# EAGLE design New_Schematic (EAGLE 9.6.2)
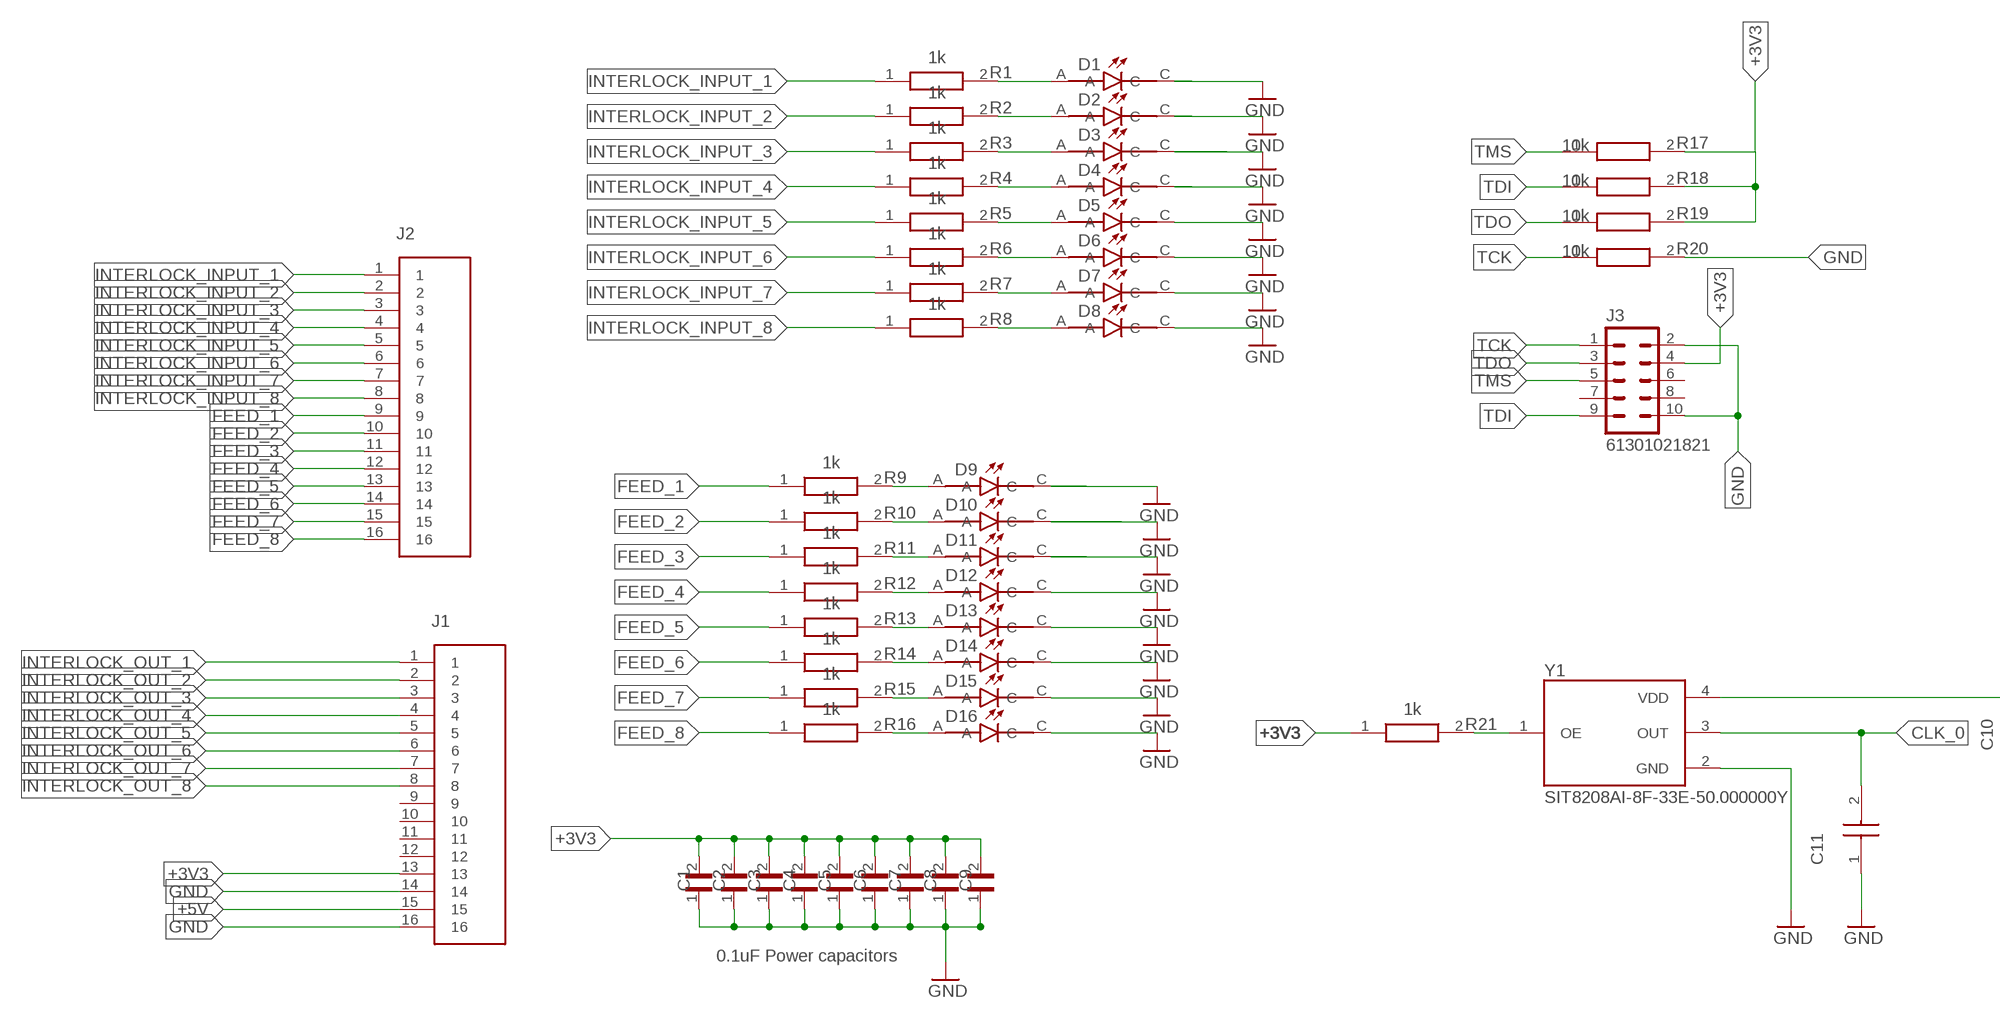
[diagram p0: schematic, sheet 1, part 1 of 2]
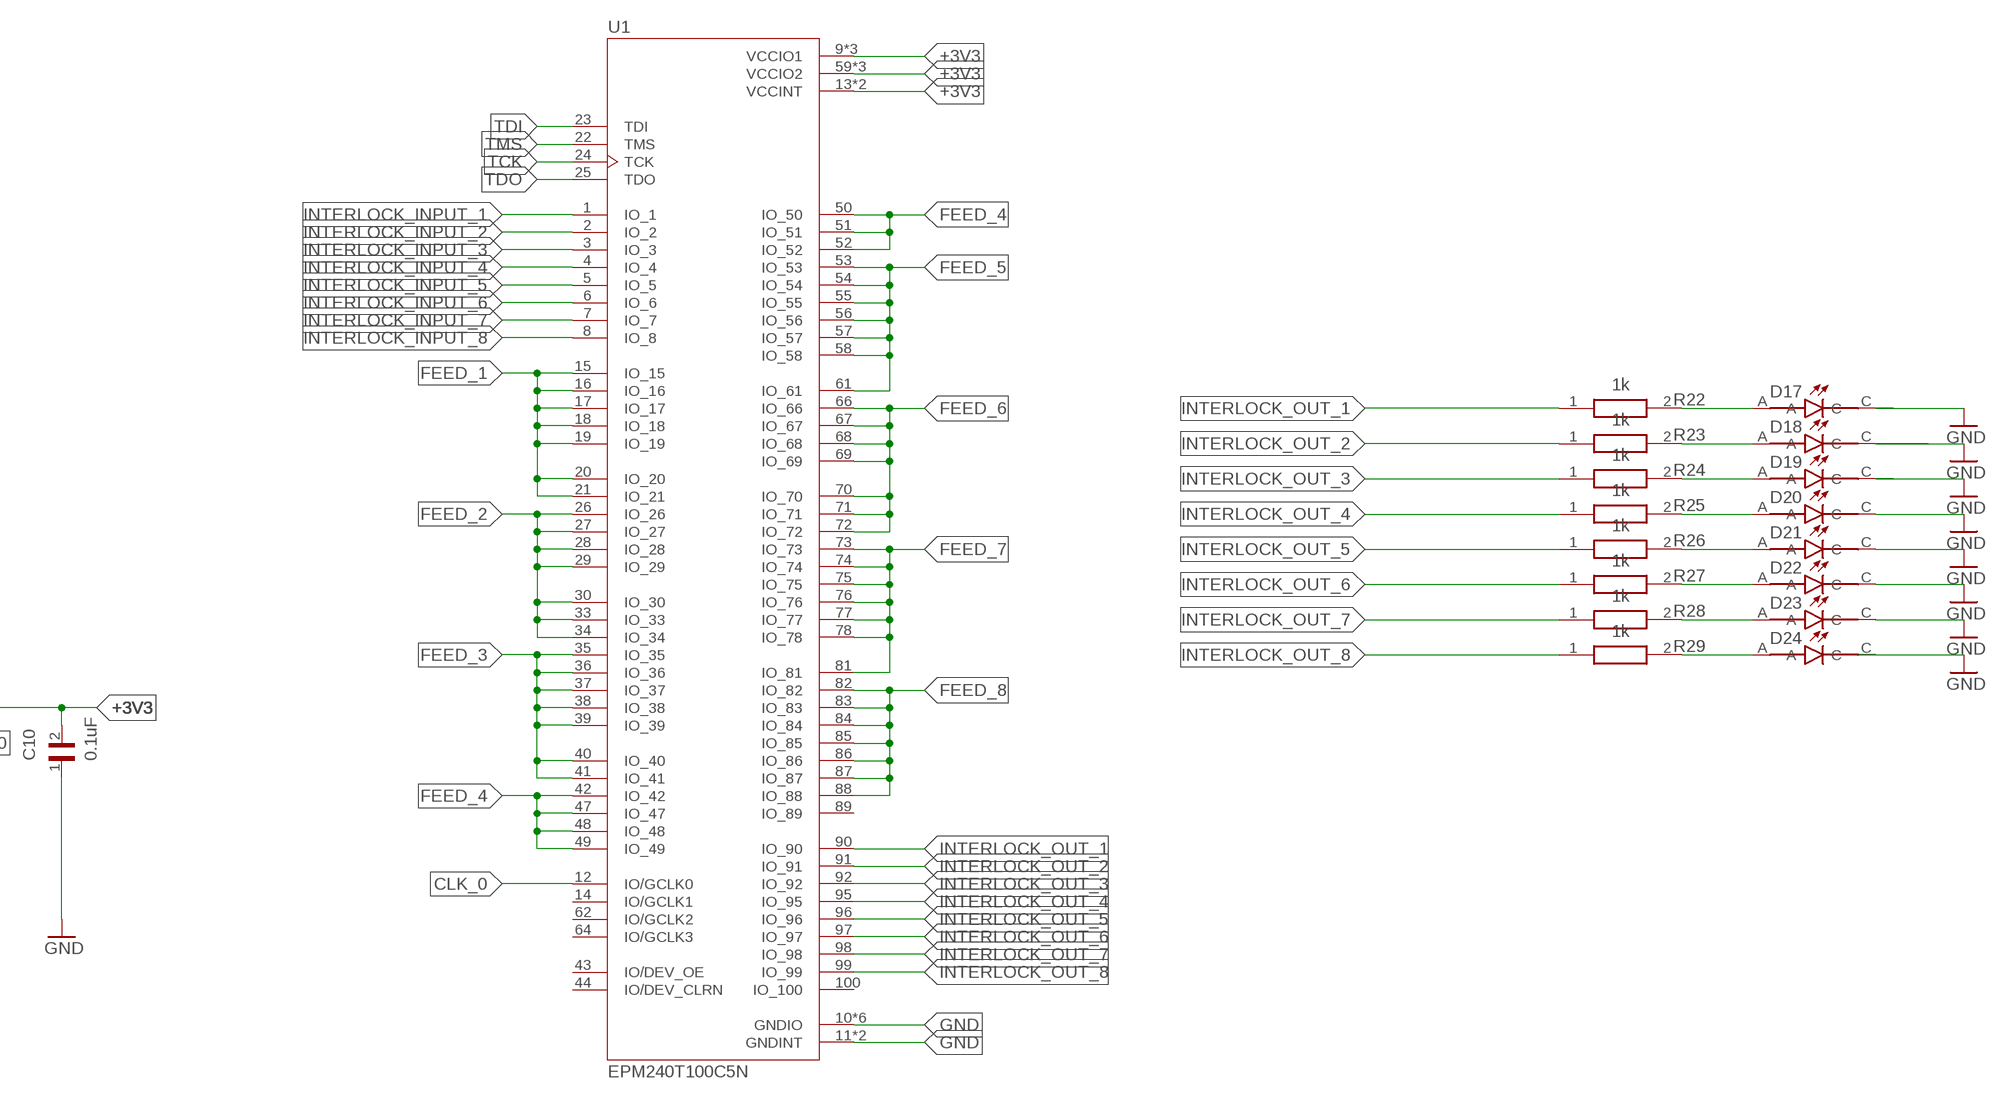
[diagram p1: schematic, sheet 1, part 2 of 2]

## Parts
C1  GRM155R70J104KA01D  [CAPC1005X55N]
C2  GRM155R70J104KA01D  [CAPC1005X55N]
C3  GRM155R70J104KA01D  [CAPC1005X55N]
C4  GRM155R70J104KA01D  [CAPC1005X55N]
C5  GRM155R70J104KA01D  [CAPC1005X55N]
C6  GRM155R70J104KA01D  [CAPC1005X55N]
C7  GRM155R70J104KA01D  [CAPC1005X55N]
C8  GRM155R70J104KA01D  [CAPC1005X55N]
C9  GRM155R70J104KA01D  [CAPC1005X55N]
C10  GRM155R70J104KA01D  [CAPC1005X55N]
C11  GRM1883U2A150JZ01B  [CAPC1608X90N]
D1  HSMS-C190  [LEDM1608X80]
D2  HSMS-C190  [LEDM1608X80]
D3  HSMS-C190  [LEDM1608X80]
D4  HSMS-C190  [LEDM1608X80]
D5  HSMS-C190  [LEDM1608X80]
D6  HSMS-C190  [LEDM1608X80]
D7  HSMS-C190  [LEDM1608X80]
D8  HSMS-C190  [LEDM1608X80]
D9  HSMS-C190  [LEDM1608X80]
D10  HSMS-C190  [LEDM1608X80]
D11  HSMS-C190  [LEDM1608X80]
D12  HSMS-C190  [LEDM1608X80]
D13  HSMS-C190  [LEDM1608X80]
D14  HSMS-C190  [LEDM1608X80]
D15  HSMS-C190  [LEDM1608X80]
D16  HSMS-C190  [LEDM1608X80]
D17  HSMS-C190  [LEDM1608X80]
D18  HSMS-C190  [LEDM1608X80]
D19  HSMS-C190  [LEDM1608X80]
D20  HSMS-C190  [LEDM1608X80]
D21  HSMS-C190  [LEDM1608X80]
D22  HSMS-C190  [LEDM1608X80]
D23  HSMS-C190  [LEDM1608X80]
D24  HSMS-C190  [LEDM1608X80]
J1  1-2314812-6  [TE_1-2314812-6]
J2  1-2314812-6  [TE_1-2314812-6]
J3  61301021821  [2X05-PIN]
R1  ERJS03D1001V  [RESC1608X55N]
R2  ERJS03D1001V  [RESC1608X55N]
R3  ERJS03D1001V  [RESC1608X55N]
R4  ERJS03D1001V  [RESC1608X55N]
R5  ERJS03D1001V  [RESC1608X55N]
R6  ERJS03D1001V  [RESC1608X55N]
R7  ERJS03D1001V  [RESC1608X55N]
R8  ERJS03D1001V  [RESC1608X55N]
R9  ERJS03D1001V  [RESC1608X55N]
R10  ERJS03D1001V  [RESC1608X55N]
R11  ERJS03D1001V  [RESC1608X55N]
R12  ERJS03D1001V  [RESC1608X55N]
R13  ERJS03D1001V  [RESC1608X55N]
R14  ERJS03D1001V  [RESC1608X55N]
R15  ERJS03D1001V  [RESC1608X55N]
R16  ERJS03D1001V  [RESC1608X55N]
R17  CRT0603-BY-1002EAS  [RESC1608X60N]
R18  CRT0603-BY-1002EAS  [RESC1608X60N]
R19  CRT0603-BY-1002EAS  [RESC1608X60N]
R20  CRT0603-BY-1002EAS  [RESC1608X60N]
R21  ERJS03D1001V  [RESC1608X55N]
R22  ERJS03D1001V  [RESC1608X55N]
R23  ERJS03D1001V  [RESC1608X55N]
R24  ERJS03D1001V  [RESC1608X55N]
R25  ERJS03D1001V  [RESC1608X55N]
R26  ERJS03D1001V  [RESC1608X55N]
R27  ERJS03D1001V  [RESC1608X55N]
R28  ERJS03D1001V  [RESC1608X55N]
R29  ERJS03D1001V  [RESC1608X55N]
U1  EPM240T100C5N  [QFP50P1600X1600X120-100N]
Y1  SIT8208AI-8F-33E-50.000000Y  [OSC_SIT8208AI-8F-33E-50.000000Y]

## Nets
+3V3: C1.2 C2.2 C3.2 C4.2 C5.2 C6.2 C7.2 C8.2 C9.2 C10.2 J1.13 J3.4 R17.2 R18.2 R19.2 R21.1 U1.9(VCCIO1) U1.13(VCCINT) U1.31(VCCIO1) U1.45(VCCIO1) U1.59(VCCIO2) U1.63(VCCINT) U1.80(VCCIO2) U1.94(VCCIO2) Y1.4(VDD)
+5V: J1.15
CLK_0: C11.2 U1.12(IO/GCLK0) Y1.3(OUT)
FEED_1: J2.9 R9.1 U1.15(IO_15) U1.16(IO_16) U1.17(IO_17) U1.18(IO_18) U1.19(IO_19) U1.20(IO_20) U1.21(IO_21)
FEED_2: J2.10 R10.1 U1.26(IO_26) U1.27(IO_27) U1.28(IO_28) U1.29(IO_29) U1.30(IO_30) U1.33(IO_33) U1.34(IO_34)
FEED_3: J2.11 R11.1 U1.35(IO_35) U1.36(IO_36) U1.37(IO_37) U1.38(IO_38) U1.39(IO_39) U1.40(IO_40) U1.41(IO_41)
FEED_4: J2.12 R12.1 U1.42(IO_42) U1.47(IO_47) U1.48(IO_48) U1.49(IO_49) U1.50(IO_50) U1.51(IO_51) U1.52(IO_52)
FEED_5: J2.13 R13.1 U1.53(IO_53) U1.54(IO_54) U1.55(IO_55) U1.56(IO_56) U1.57(IO_57) U1.58(IO_58) U1.61(IO_61)
FEED_6: J2.14 R14.1 U1.66(IO_66) U1.67(IO_67) U1.68(IO_68) U1.69(IO_69) U1.70(IO_70) U1.71(IO_71) U1.72(IO_72)
FEED_7: J2.15 R15.1 U1.73(IO_73) U1.74(IO_74) U1.75(IO_75) U1.76(IO_76) U1.77(IO_77) U1.78(IO_78) U1.81(IO_81)
FEED_8: J2.16 R16.1 U1.82(IO_82) U1.83(IO_83) U1.84(IO_84) U1.85(IO_85) U1.86(IO_86) U1.87(IO_87) U1.88(IO_88)
GND: C1.1 C2.1 C3.1 C4.1 C5.1 C6.1 C7.1 C8.1 C9.1 C10.1 C11.1 D1.C D2.C D3.C D4.C D5.C D6.C D7.C D8.C D9.C D10.C D11.C D12.C D13.C D14.C D15.C D16.C D17.C D18.C D19.C D20.C D21.C D22.C D23.C D24.C J1.14 J1.16 J3.2 J3.10 R20.2 U1.10(GNDIO) U1.11(GNDINT) U1.32(GNDIO) U1.46(GNDIO) U1.60(GNDIO) U1.65(GNDINT) U1.79(GNDIO) U1.93(GNDIO) Y1.2(GND)
INTERLOCK_INPUT_1: J2.1 R1.1 U1.1(IO_1)
INTERLOCK_INPUT_2: J2.2 R2.1 U1.2(IO_2)
INTERLOCK_INPUT_3: J2.3 R3.1 U1.3(IO_3)
INTERLOCK_INPUT_4: J2.4 R4.1 U1.4(IO_4)
INTERLOCK_INPUT_5: J2.5 R5.1 U1.5(IO_5)
INTERLOCK_INPUT_6: J2.6 R6.1 U1.6(IO_6)
INTERLOCK_INPUT_7: J2.7 R7.1 U1.7(IO_7)
INTERLOCK_INPUT_8: J2.8 R8.1 U1.8(IO_8)
INTERLOCK_OUT_1: J1.1 R22.1 U1.90(IO_90)
INTERLOCK_OUT_2: J1.2 R23.1 U1.91(IO_91)
INTERLOCK_OUT_3: J1.3 R24.1 U1.92(IO_92)
INTERLOCK_OUT_4: J1.4 R25.1 U1.95(IO_95)
INTERLOCK_OUT_5: J1.5 R26.1 U1.96(IO_96)
INTERLOCK_OUT_6: J1.6 R27.1 U1.97(IO_97)
INTERLOCK_OUT_7: J1.7 R28.1 U1.98(IO_98)
INTERLOCK_OUT_8: J1.8 R29.1 U1.99(IO_99)
N$1: D2.A R2.2
N$2: D3.A R3.2
N$3: D4.A R4.2
N$4: D5.A R5.2
N$5: D6.A R6.2
N$6: D7.A R7.2
N$7: D8.A R8.2
N$8: D16.A R16.2
N$9: D1.A R1.2
N$10: R21.2 Y1.1(OE)
N$11: D9.A R9.2
N$12: D17.A R22.2
N$13: D18.A R23.2
N$14: D10.A R10.2
N$15: D11.A R11.2
N$16: D12.A R12.2
N$17: D13.A R13.2
N$18: D14.A R14.2
N$19: D15.A R15.2
N$29: D19.A R24.2
N$30: D20.A R25.2
N$31: D21.A R26.2
N$32: D22.A R27.2
N$33: D23.A R28.2
N$34: D24.A R29.2
TCK: J3.1 R20.1 U1.24(TCK)
TDI: J3.9 R18.1 U1.23(TDI)
TDO: J3.3 R19.1 U1.25(TDO)
TMS: J3.5 R17.1 U1.22(TMS)
Unconnected: J1.9 J1.10 J1.11 J1.12 J3.6 J3.7 J3.8 U1.14(IO/GCLK1) U1.43(IO/DEV_OE) U1.44(IO/DEV_CLRN) U1.62(IO/GCLK2) U1.64(IO/GCLK3) U1.89(IO_89) U1.100(IO_100)

## Notes on the sheet
- 0.1uF Power capacitors

## Library data of the parts
C1-C9 = GRM155R70J104KA01D:GRM155R70J104KA01D: CAP, MLCC, X7R, 0.1UF, 6.3V, 0402; CHECK_PRICES: https://www.snapeda.com/parts/GRM155R70J104KA01D/Murata+Electronics+North+America/view-part/?ref=eda; DESCRIPTION: SMD Capacitor X7R(EIA) with Capacitance: 0.10uF Tol. 10%. Rated Voltage: 6.3Vdc; DIGIKEY_PART_NUMBER: 490-6319-2-ND; MF: Murata; MP: GRM155R70J104KA01D; PACKAGE: 1005 Taiyo Yuden; PURCHASE-URL: https://www.snapeda.com/api/url_track_click_mouser/?unipart_id=287038&manufacturer=Murata&part_name=GRM155R70J104KA01D&search_term=0.1uf cap; SNAPEDA_LINK: https://www.snapeda.com/parts/GRM155R70J104KA01D/Murata+Electronics+North+America/view-part/?ref=snap
C10 = GRM155R70J104KA01D:GRM155R70J104KA01D: CAP, MLCC, X7R, 0.1UF, 6.3V, 0402; C10: 0.1uF; CHECK_PRICES: https://www.snapeda.com/parts/GRM155R70J104KA01D/Murata+Electronics+North+America/view-part/?ref=eda; DESCRIPTION: SMD Capacitor X7R(EIA) with Capacitance: 0.10uF Tol. 10%. Rated Voltage: 6.3Vdc; DIGIKEY_PART_NUMBER: 490-6319-2-ND; MF: Murata; MP: GRM155R70J104KA01D; PACKAGE: 1005 Taiyo Yuden; PURCHASE-URL: https://www.snapeda.com/api/url_track_click_mouser/?unipart_id=287038&manufacturer=Murata&part_name=GRM155R70J104KA01D&search_term=0.1uf cap; SNAPEDA_LINK: https://www.snapeda.com/parts/GRM155R70J104KA01D/Murata+Electronics+North+America/view-part/?ref=snap
C11 = GRM1883U2A150JZ01B:GRM1883U2A150JZ01B: Multilayer Ceramic Capacitors MLCC - SMD/SMT Source: Datasheet <http://componentsearchengine.com/Datasheets/1/GRM1883U2A150JZ01B.pdf>; C11: 15pF; DESCRIPTION: Multilayer Ceramic Capacitors MLCC - SMD/SMT; HEIGHT: 0.9mm; MANUFACTURER_NAME: Murata Electronics; MANUFACTURER_PART_NUMBER: GRM1883U2A150JZ01B; MOUSER_PART_NUMBER: N/A; MOUSER_PRICE-STOCK: https://www.mouser.com/Search/Refine.aspx?Keyword=N%2FA
D1-D24 = HSMS-C190:HSMS-C190: SMD LED [Broadcom] HSMS-C190 SMD LED Check availability <https://pricing.snapeda.com/parts/HSMS-C190/Broadcom%20Limited/view-part?ref=eda>; AVAILABILITY: In Stock; CHECK_PRICES: https://www.snapeda.com/parts/HSMS-C190/Broadcom+Limited/view-part/?ref=eda; DESCRIPTION: LED; SMD; 0603; red; 2.8-10mcd; 1.6x0.8mm; 170°; 2.1÷2.6V; 20mA; MF: Broadcom Limited; MP: HSMS-C190; PACKAGE: 0603 Avago; PRICE: None; SNAPEDA_LINK: https://www.snapeda.com/parts/HSMS-C190/Broadcom+Limited/view-part/?ref=snap
J1 J2 = 1-2314812-6:1-2314812-6; CHECK_PRICES: https://www.snapeda.com/parts/1-2314812-6/TE+Connectivity/view-part/?ref=eda; COMMENT: 1-2314812-6; DESCRIPTION: Socket Receptacle 16P,2MM,B-B,REC,DRVT,2.0,0.1AU,TB,W/CAP 16 POS; DIGIKEY_PART_NUMBER: 17-1-2314812-6-ND; MF: TE Connectivity; MP: 1-2314812-6; PACKAGE: None; PURCHASE-URL: https://www.snapeda.com/api/url_track_click_mouser/?unipart_id=4241776&manufacturer=TE Connectivity&part_name=1-2314812-6&search_term=1-2314812-6; SNAPEDA_LINK: https://www.snapeda.com/parts/1-2314812-6/TE+Connectivity/view-part/?ref=snap
J3 = 61301021821:61301021821: http://www.mouser.com/ProductDetail/Wurth-Electronics/61301021821/?qs=sGAEpiMZZMs%252bGHln7q6pm%252bxnWLfLL2%2f9OV8dbd6CAaU%3d Check availability <https://pricing.snapeda.com/parts/61301021821/Wurth%20Electronics/view-part?ref=eda>; AVAILABILITY: In Stock; CHECK_PRICES: https://www.snapeda.com/parts/61301021821/Wurth+Electronics+Inc./view-part/?ref=eda; DESCRIPTION: 10 Position Header Connector Through Hole; MF: Wurth Electronics; MP: 61301021821; PACKAGE: None; PRICE: None; PURCHASE-URL: https://www.snapeda.com/api/url_track_click_mouser/?unipart_id=1736865&manufacturer=Wurth Electronics&part_name=61301021821&search_term=connector headers; SNAPEDA_LINK: https://www.snapeda.com/parts/61301021821/Wurth+Electronics+Inc./view-part/?ref=snap
R1-R16 R21-R29 = ERJS03D1001V:ERJS03D1001V: Anti-Sulfurated Thick Film Chip Resistor, 0603, 0.1W Source: Datasheet <https://industrial.panasonic.com/cdbs/www-data/pdf/RDP0000/AOA0000C334.pdf>; DESCRIPTION: Anti-Sulfurated Thick Film Chip Resistor, 0603, 0.1W; HEIGHT: 0.55mm; MANUFACTURER_NAME: Panasonic; MANUFACTURER_PART_NUMBER: ERJS03D1001V; R1: 1k
R17-R20 = CRT0603-BY-1002EAS:CRT0603-BY-1002EAS: Thin Film Resistors - SMD 10k0 0.1% 100mW Source: Datasheet <http://www.bourns.com/docs/Product-Datasheets/crt-as.pdf>; ARROW_PART_NUMBER: CRT0603-BY-1002EAS; ARROW_PRICE-STOCK: https://www.arrow.com/en/products/crt0603-by-1002eas/bourns; DESCRIPTION: Thin Film Resistors - SMD 10k0 0.1% 100mW; HEIGHT: 0.6mm; MANUFACTURER_NAME: Bourns; MANUFACTURER_PART_NUMBER: CRT0603-BY-1002EAS; MOUSER_PART_NUMBER: 652-CRT0603BY1002EAS; MOUSER_PRICE-STOCK: https://www.mouser.com/Search/Refine.aspx?Keyword=652-CRT0603BY1002EAS; R17: 10k
U1 = EPM240T100C5N:EPM240T100C5N: CPLD MAX II Family 192 Macro Cells 201.1MHz 0.18um Technology 2.5V/3.3V 100-Pin TQFP; CHECK_PRICES: https://www.snapeda.com/parts/EPM240T100C5N/Intel/view-part/?ref=eda; DESCRIPTION: IC CPLD 192MC 4.7NS 100TQFP; DIGIKEY_PART_NUMBER: 544-1964-ND; MF: Intel; MP: EPM240T100C5N; PACKAGE: QFN-100 Intel; PURCHASE-URL: https://www.snapeda.com/api/url_track_click_mouser/?unipart_id=38204&manufacturer=Intel&part_name=EPM240T100C5N&search_term=epm240t100c5n; SNAPEDA_LINK: https://www.snapeda.com/parts/EPM240T100C5N/Intel/view-part/?ref=snap
Y1 = SIT8208AI-8F-33E-50.000000Y:SIT8208AI-8F-33E-50.000000Y: Check availability <https://pricing.snapeda.com/parts/SIT8208AI-8F-33E-50.000000Y/SiTime/view-part?ref=eda>; AVAILABILITY: In Stock; CHECK_PRICES: https://www.snapeda.com/parts/SIT8208AI-8F-33E-50.000000Y/SiTime/view-part/?ref=eda; DESCRIPTION: 50 MHz XO (Standard) LVCMOS, LVTTL Oscillator 3.3V Enable/Disable 4-SMD, No Lead; MF: SiTime; MP: SIT8208AI-8F-33E-50.000000Y; PACKAGE: NON STANDARD-4 Rochester Electronics; PRICE: None; SNAPEDA_LINK: https://www.snapeda.com/parts/SIT8208AI-8F-33E-50.000000Y/SiTime/view-part/?ref=snap

## Board
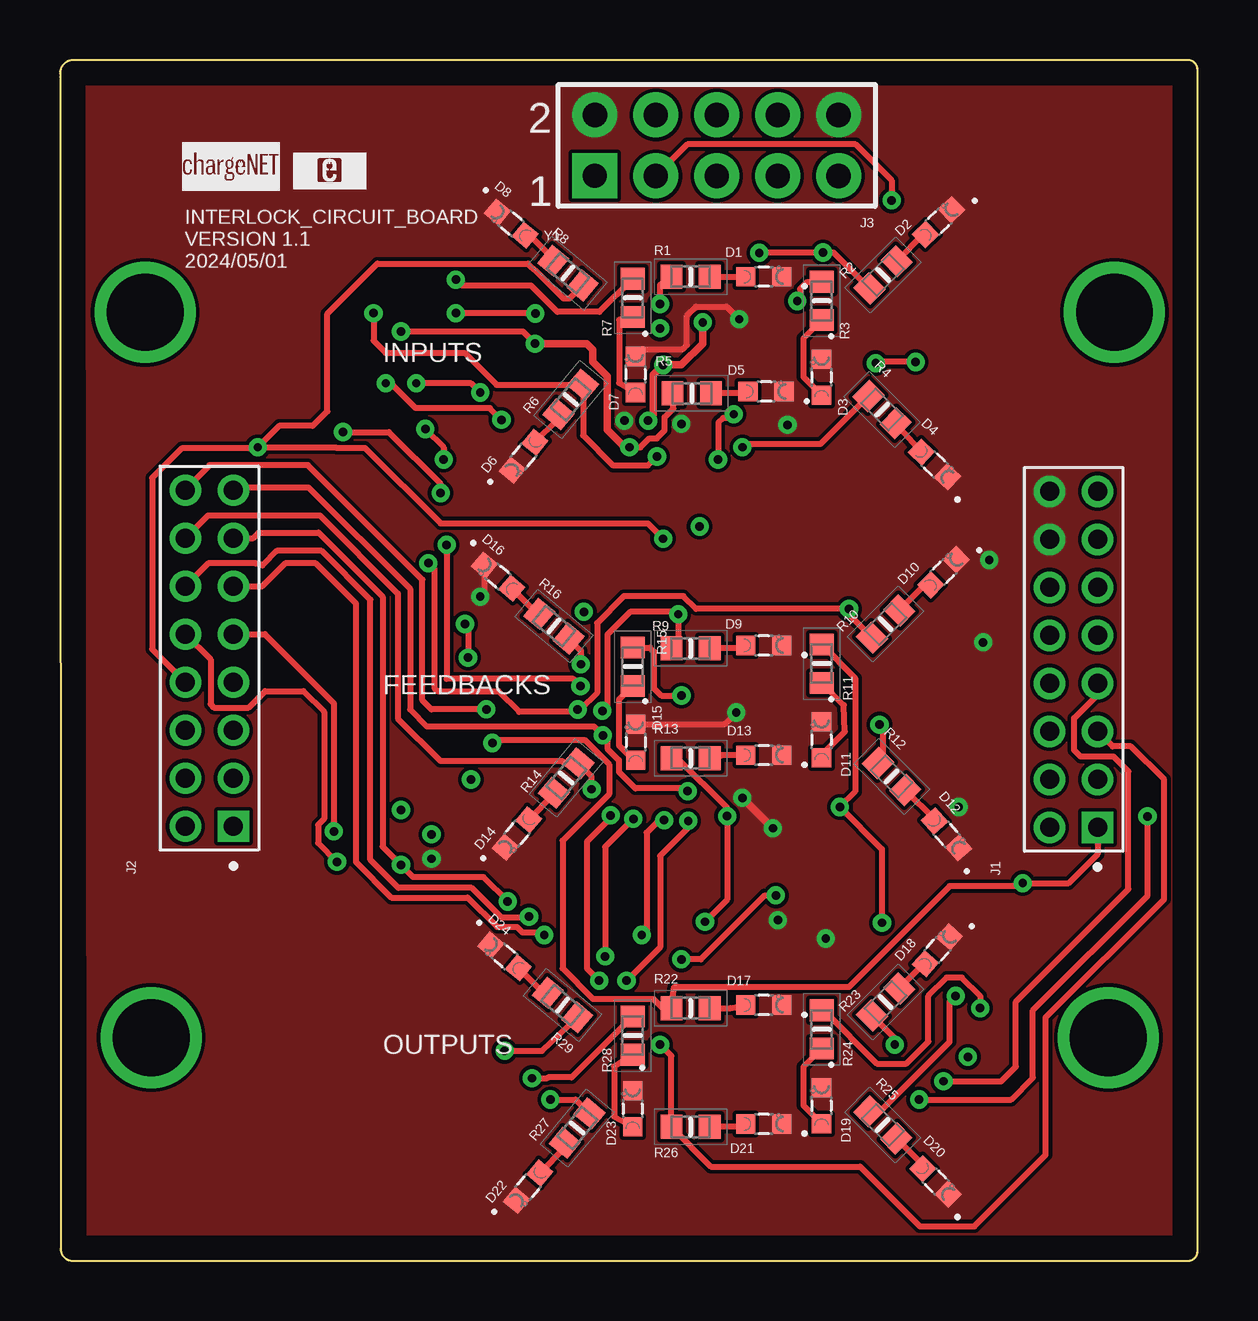
[diagram p2: board, top side]
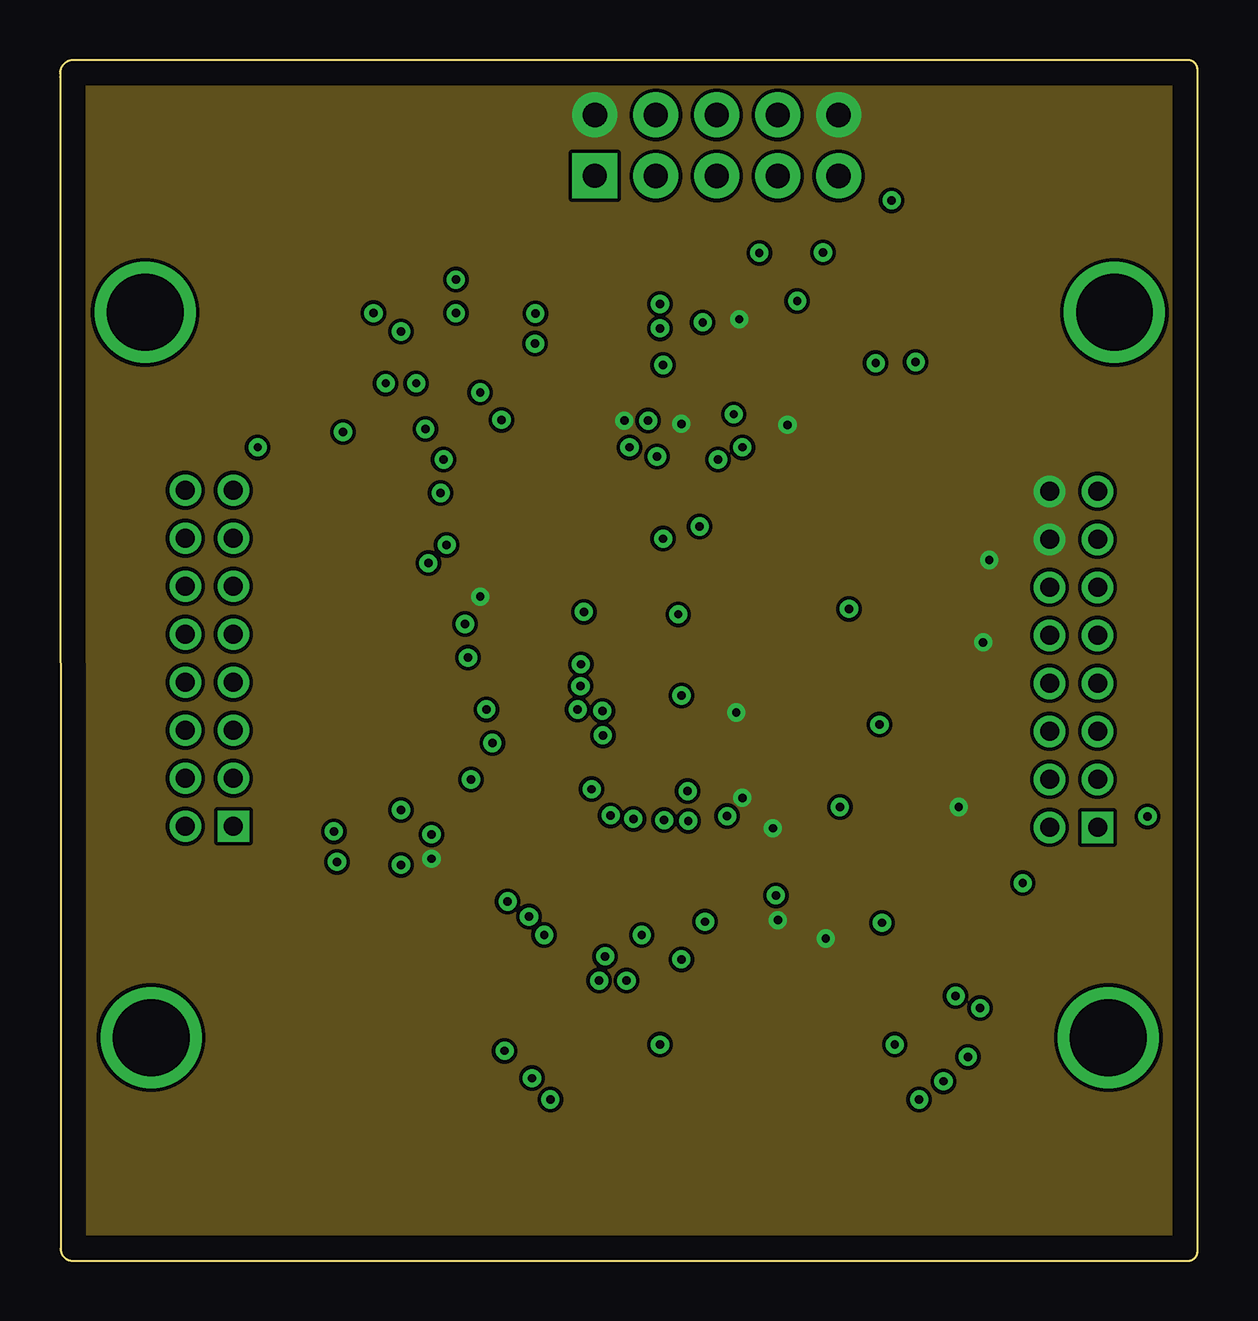
[diagram p3: board, inner layer Route2]
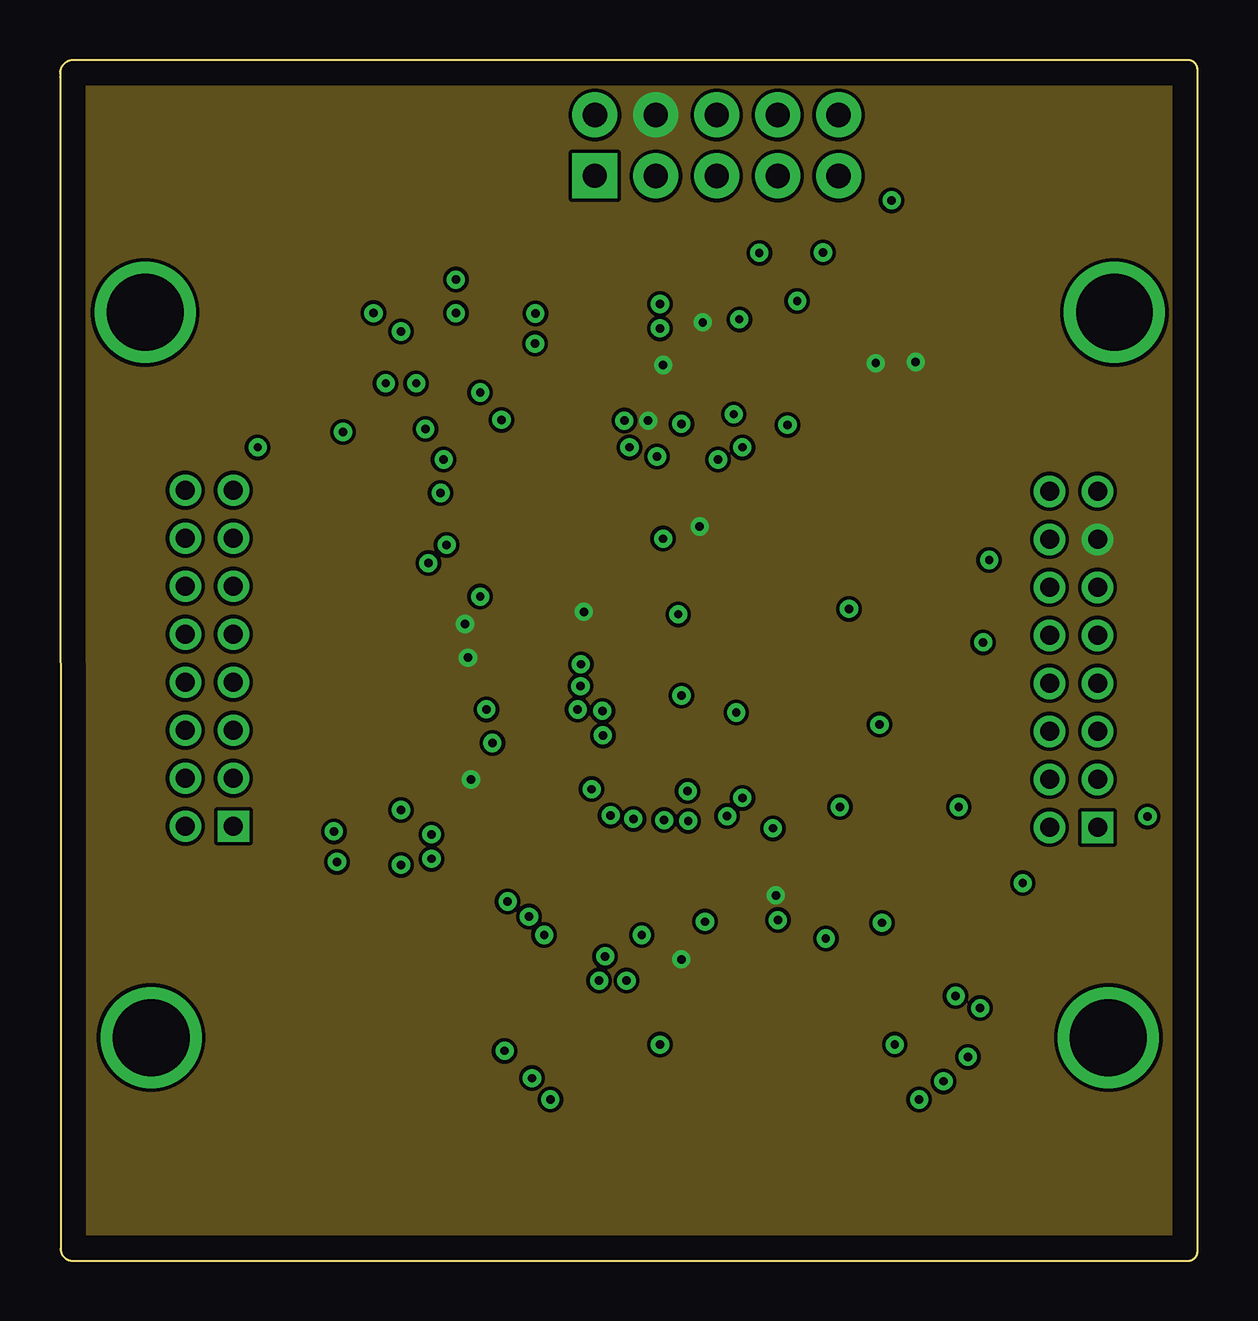
[diagram p4: board, inner layer Route3]
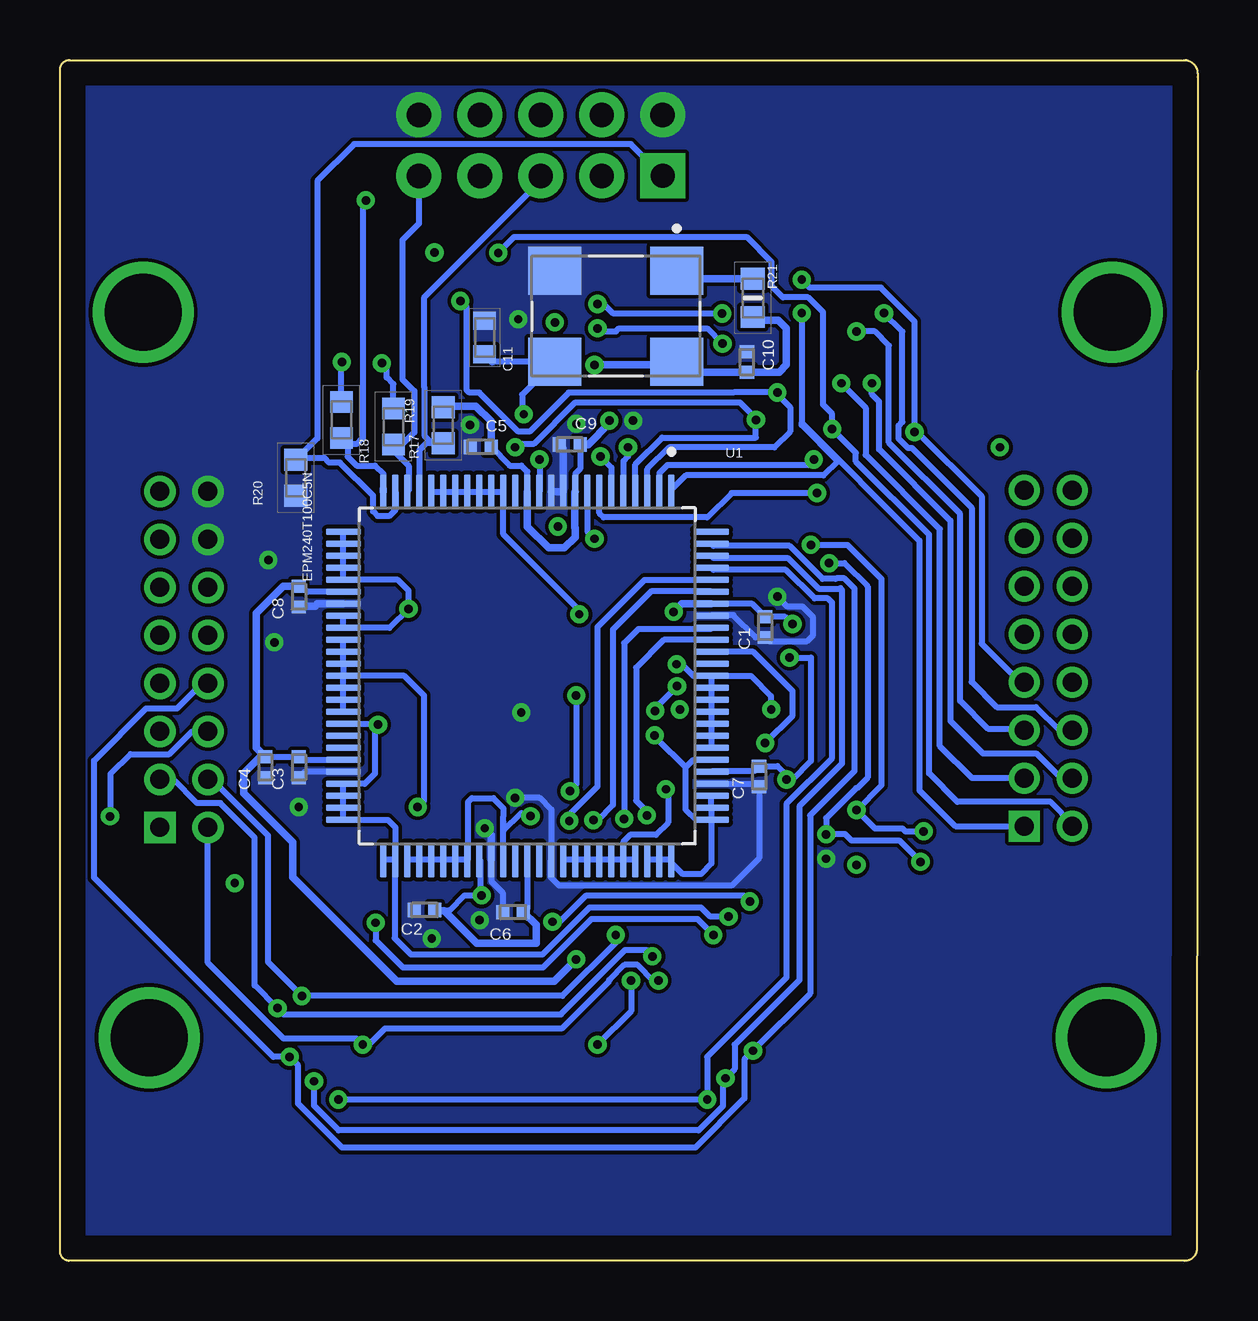
[diagram p5: board, bottom side, seen from below]

Size 47.4 x 50.04 mm. Coordinates in mm from the lower left corner, seen from the top.
Outline: 0.53,0 47.02,0 arc90 47.4,0.43 47.4,49.63 arc90 46.99,50.04 0.56,50.04 arc90 0,49.48 0,49.33 0.03,0.51 arc90 0.53,0
Copper layers (1*2+3*16): Top 0.035mm / dielectric 1.5mm / Route2 0.035mm / dielectric 0.15mm / Route3 0.035mm / dielectric 0.2mm / Bottom 0.035mm
Design rules "default *": minimum track width 6mil, minimum drill 0.35mm, track to track 6mil, track to pad 6mil, pad to pad 6mil, via to via 6mil, smd to smd 6mil, copper to edge 40mil, drill to drill 6mil, minimum pad ring 10mil, minimum via ring 8mil, stop-mask expansion 4mil, vias tented up to drill 0mil, thermal gap 10mil

### Footprints (pad centres in the part's own frame; a part is rotated, then mirrored left to right if it is on the bottom)
CAPC1005X55N = smd 0.54 x 0.6: 1 -0.432,0; 2 0.432,0
CAPC1608X90N = smd 0.75 x 0.94: 1 -0.7,0; 2 0.7,0
LEDM1608X80 = smd 0.8 x 0.8: A 0.75,0; C -0.75,0
TE_1-2314812-6 = drill 0.8 pad 1.15 square: 1 0,0 | drill 0.8 pad 1.15: 2 0,2; 3 2,0; 4 2,2; 5 4,0; 6 4,2; 7 6,0; 8 6,2; 9 8,0; 10 8,2; 11 10,0; 12 10,2; 13 12,0; 14 12,2; 15 14,0; 16 14,2
2X05-PIN = drill 1.01 pad 1.88 square: 1 -1.27,5.08 | drill 1.016 pad 1.88: 2 1.27,5.08; 3 -1.27,2.54; 4 1.27,2.54; 5 -1.27,0; 6 1.27,0; 7 -1.27,-2.54; 8 1.27,-2.54; 9 -1.27,-5.08; 10 1.27,-5.08
RESC1608X55N = smd 0.9 x 1: 1 -0.8,0; 2 0.8,0
RESC1608X60N = smd 0.9 x 0.95: 1 -0.75,0; 2 0.75,0
QFP50P1600X1600X120-100N = smd 1.47 x 0.28: 1 -7.67,6; 2 -7.67,5.5; 3 -7.67,5; 4 -7.67,4.5; 5 -7.67,4; 6 -7.67,3.5; 7 -7.67,3; 8 -7.67,2.5; 9 -7.67,2; 10 -7.67,1.5; 11 -7.67,1; 12 -7.67,0.5; 13 -7.67,0; 14 -7.67,-0.5; 15 -7.67,-1; 16 -7.67,-1.5; 17 -7.67,-2; 18 -7.67,-2.5; 19 -7.67,-3; 20 -7.67,-3.5; 21 -7.67,-4; 22 -7.67,-4.5; 23 -7.67,-5; 24 -7.67,-5.5; 25 -7.67,-6; 51 7.67,-6; 52 7.67,-5.5; 53 7.67,-5; 54 7.67,-4.5; 55 7.67,-4; 56 7.67,-3.5; 57 7.67,-3; 58 7.67,-2.5; 59 7.67,-2; 60 7.67,-1.5; 61 7.67,-1; 62 7.67,-0.5; 63 7.67,0; 64 7.67,0.5; 65 7.67,1; 66 7.67,1.5; 67 7.67,2; 68 7.67,2.5; 69 7.67,3; 70 7.67,3.5; 71 7.67,4; 72 7.67,4.5; 73 7.67,5; 74 7.67,5.5; 75 7.67,6 | smd 0.28 x 1.47: 26 -6,-7.67; 27 -5.5,-7.67; 28 -5,-7.67; 29 -4.5,-7.67; 30 -4,-7.67; 31 -3.5,-7.67; 32 -3,-7.67; 33 -2.5,-7.67; 34 -2,-7.67; 35 -1.5,-7.67; 36 -1,-7.67; 37 -0.5,-7.67; 38 0,-7.67; 39 0.5,-7.67; 40 1,-7.67; 41 1.5,-7.67; 42 2,-7.67; 43 2.5,-7.67; 44 3,-7.67; 45 3.5,-7.67; 46 4,-7.67; 47 4.5,-7.67; 48 5,-7.67; 49 5.5,-7.67; 50 6,-7.67; 76 6,7.67; 77 5.5,7.67; 78 5,7.67; 79 4.5,7.67; 80 4,7.67; 81 3.5,7.67; 82 3,7.67; 83 2.5,7.67; 84 2,7.67; 85 1.5,7.67; 86 1,7.67; 87 0.5,7.67; 88 0,7.67; 89 -0.5,7.67; 90 -1,7.67; 91 -1.5,7.67; 92 -2,7.67; 93 -2.5,7.67; 94 -3,7.67; 95 -3.5,7.67; 96 -4,7.67; 97 -4.5,7.67; 98 -5,7.67; 99 -5.5,7.67; 100 -6,7.67
OSC_SIT8208AI-8F-33E-50.000000Y = smd 2 x 2.2: 1 -1.905,2.54; 2 -1.905,-2.54; 3 1.905,-2.54; 4 1.905,2.54

### Placement (x,y rotation side)
C1  18.02,26.41 90 bottom
C2  32.21,14.62 0 bottom
C3  37.45,20.57 90 bottom
C4  38.84,20.57 90 bottom
C5  29.87,33.92 0 bottom
C6  28.52,14.53 0 bottom
C7  18.27,20.18 90 bottom
C8  37.45,27.68 90 bottom
C9  26.15,34.01 0 bottom
C10  18.78,37.46 270 bottom
C11  29.7,38.47 270 bottom
D1  29.32,41.01 180 top
D2  36.6,43.29 223.6 top
D3  31.73,36.82 270 top
D4  36.44,33.18 136.6 top
D5  29.42,36.23 180 top
D6  19.31,33.53 50.8 top
D7  23.98,36.94 270 top
D8  18.8,43.22 320.4 top
D9  29.32,25.65 180 top
D10  36.81,28.69 225 top
D11  31.73,21.71 270 top
D12  36.94,17.77 131.9 top
D13  29.32,21.07 180 top
D14  19.04,17.81 49.7 top
D15  23.99,21.62 270 top
D16  18.26,28.51 319.7 top
D17  29.32,10.66 180 top
D18  36.56,12.95 228.2 top
D19  31.73,6.47 270 top
D20  36.48,3.32 135 top
D21  29.32,5.71 180 top
D22  19.51,3.09 49.7 top
D23  23.86,6.34 270 top
D24  18.52,12.69 320.2 top
J1  43.23,18.07 90 top
J2  7.22,18.11 90 top
J3  27.36,46.48 90 top
R1  26.27,41.01 0 top
R2  34.29,41.08 45 top
R3  31.73,40 270 top
R4  34.25,35.47 315 top
R5  26.33,36.14 0 top
R6  21.28,35.89 230.2 top
R7  23.86,40.12 270 top
R8  21.16,41.16 140.2 top
R9  26.27,25.52 0 top
R10  34.4,26.53 45 top
R11  31.73,24.88 270 top
R12  34.65,20.18 315 top
R13  26.27,20.95 0 top
R14  21.09,20.12 230.2 top
R15  23.86,24.76 270 top
R16  20.58,26.45 140.2 top
R17  31.42,34.82 90 bottom
R18  33.5,34.76 90 bottom
R19  35.67,35.04 90 bottom
R20  37.57,32.63 270 bottom
R21  18.52,40.12 90 bottom
R22  26.27,10.53 0 top
R23  34.4,10.79 45 top
R24  31.73,9.64 270 top
R25  34.28,5.67 315 top
R26  26.27,5.58 0 top
R27  21.55,5.53 230.2 top
R28  23.86,9.39 270 top
R29  20.94,10.66 140.2 top
U1  27.92,24.38 270 bottom
Y1  24.24,39.36 270 bottom

### Tracks (layer width: path | path; a pad name or v marks a point on that pad's centre or on a via)
+3V3  (via drill 0.35)
  Top 0.254: v25.89,12.56 26.7,12.56 29.37,15.23 v29.83,15.23 | v33.99,37.41 34.04,37.46 35.63,37.46 35.63,37.45 v35.65,37.45 | v16.87,26.53 17,26.41 v17,25.14
  Top 0.305: v26.78,39.11 26.78,38.22 25.89,37.33 v25.13,37.33 24.72,36.92 24.72,35.25 24.51,35.04 v24.51,35.01
  Bottom 0.254: U1.63 27.92,14.69 C6.2 | U1.31 37.09,27.88 37.32,28.11 C8.2 | U1.80 20.21,20.42 18.47,20.42 C7.2 17.51,20.62 17.08,20.18 17.08,20.11 v17.13,20.06 16.87,20.06 16.11,20.82 16.11,25.14 v17,25.14 | U1.94 18.55,27.38 C1.2 17.18,26.84 v16.87,26.53 | C9.2 25.72,33 25.92,32.8 U1.9 | C2.2 31.16,14.62 30.55,15.23 v29.83,15.23 29.88,15.28 29.88,16.66 U1.59 | U1.45 37.33,20.88 C3.2 C4.2 39.05,21 | R18.2 33.5,36.53 33.79,36.82 33.79,37.21 v33.99,37.41 | R19.2 35.67,37.43 v35.65,37.45 | U1.13 27.92,32.88 28.18,33.14 28.66,33.14 C5.2 | 25,37.46 v25.13,37.33
  Bottom 0.305: R21.1 18.4,39.2 17.47,39.2 17.13,38.85 17.13,37.33 17.43,37.02 C10.2 21.27,37.02 Y1.4 21.83,37.33 v25.13,37.33 | C6.2 27.56,14 27.56,13.24 30.04,13.24 31.4,14.6 31.75,14.6 C2.2 | C5.2 29.44,34.98 30.08,35.62 31.37,35.62 R17.2 | U1.9 25.94,32.03 25.94,30.55 25.94,30.16 26.38,29.71 27.03,29.71 27.92,30.6 U1.13 | C9.2 25.38,34.01 24.51,34.89 v24.51,35.01 | C8.2 38.09,28.11 39.23,26.98 39.23,21.38 C4.2 | U1.94 21.49,27.38 v21.83,27.04 | v25.89,12.56 26.81,11.65 33.36,11.65 37.7,15.99 37.7,17.44 39.73,19.48 39.73,20.31 39.05,21
  other vias: 26.65,30.6
  pour Route3 (no thermals): 0.27,49.78 0.27,0.33 47.14,0.33 47.14,49.78
CLK_0  (via drill 0.35)
  Top 0.254: v28.07,35.28 27.91,35.12 27.62,35.12 27.43,34.93 27.43,33.41 v27.41,33.39
  Bottom 0.254: v27.41,33.39 27.41,32.05 U1.12 | v28.07,35.28 28.14,35.35 28.14,36.09 Y1.3 29.38,37.46
  Bottom 0.305: C11.2 29.38,37.46
FEED_1  (via drill 0.35)
  Top 0.254: R9.1 25.76,25.81 v25.76,26.94 25.66,27.05 23.76,27.05 22.82,26.11 22.82,23.04 22.69,22.92 v22.6,22.92 | v21.69,23.95 21.39,24.25 16.11,24.25 v16.11,29.84 | J2.9 8.53,26.11 11.41,23.23 v11.41,17.9
  Bottom 0.254: U1.21 U1.20 U1.19 U1.18 U1.17 U1.16 U1.15 28.92,30.27 25.76,27.11 v25.76,26.94 | v11.41,17.9 12.17,17.9 12.3,18.03 13.44,18.03 v14.21,18.79 13.17,19.83 13.17,28.42 14.59,29.84 v16.11,29.84 | v22.6,22.92 22.6,23.02 22.44,23.17 21.69,23.93 v21.69,23.95
FEED_2  (via drill 0.35)
  Top 0.254: R10.1 32.88,26.93 v32.88,27.17 26.5,27.17 25.98,27.7 23.5,27.7 22.38,26.58 22.38,23.67 21.68,22.98 v21.57,22.98 | v15.35,29.07 15.6,28.82 15.6,23.87 15.73,23.74 18.27,23.74 19.13,22.88 21.32,22.88 21.42,22.98 v21.57,22.98 | v21.57,22.98 21.59,22.96 | v11.54,16.63 10.76,17.41 10.76,18.17 11.01,18.42 11.01,22.88 10.14,23.74 8.54,23.74 7.86,23.05 6.42,23.05 6.27,23.2 6.27,25.06 J2.10
  Bottom 0.254: U1.26 U1.27 U1.28 U1.29 U1.30 33.32,28.38 32.88,27.93 v32.88,27.17 33.67,26.38 U1.34 U1.33 | v11.54,16.63 12.43,17.52 14.42,17.52 14.7,17.79 15.45,17.79 v15.48,17.77 15.48,18.45 14.23,19.7 14.18,19.7 13.75,20.13 13.75,28.11 14.71,29.07 v15.35,29.07
FEED_3  (via drill 0.35)
  Top 0.254: v20.18,13.58 20.07,13.68 19.27,13.68 19.04,13.91 18.21,13.91 16.98,15.14 13.81,15.14 12.32,16.63 12.32,27.4 10.66,29.06 9.38,29.06 8.43,28.11 J2.11 | R11.1 33.13,24.29 33.13,19.55 v32.49,18.91 34.25,17.16 v34.25,14.09
  Bottom 0.254: U1.41 U1.40 U1.39 U1.38 | U1.38 33.05,24.38 32.24,23.56 32.24,19.17 v32.49,18.91 | v34.25,14.09 34.25,13.36 33.11,12.23 27.26,12.23 25.25,14.24 20.83,14.24 v20.18,13.58 | U1.35 U1.36 U1.37 U1.38
FEED_4  (via drill 0.35)
  Top 0.254: v19.54,14.34 19.52,14.32 18.38,14.32 17.15,15.55 14.1,15.55 12.94,16.71 12.94,27.55 10.9,29.58 9.04,29.58 8.44,28.99 8.15,29.06 6.17,29.06 J2.12 | R12.1 34.27,20.93 34.27,22.22 v34.15,22.34
  Bottom 0.254: U1.52 33.46,16.67 33.46,13.45 32.77,12.77 27.3,12.77 25.34,14.72 20.68,14.72 20.3,14.34 v19.54,14.34 | U1.42 34.18,22.38 v34.15,22.34 34.27,22.22 34.27,20.31 34.7,19.88 U1.47 U1.48 U1.49 U1.50 33.73,18.38 33.42,18.06 U1.52 | U1.52 U1.51
FEED_5  (via drill 0.35)
  Top 0.254: v26.88,14.13 27.8,15.05 v27.8,18.53 27.8,18.88 25.73,20.95 R13.1 | v18.65,14.98 17.64,15.99 14.71,15.99 v14.21,16.5 13.44,17.26 13.44,27.68 10.78,30.34 8.28,30.34 8.05,30.11 J2.13
  Bottom 0.254: U1.53 U1.54 U1.55 U1.56 U1.57 U1.58 30.4,16.73 30.4,19.11 30.24,19.28 29.34,19.28 28.92,18.86 28.92,18.54 28.92,18.29 28.92,17.91 | U1.61 28.92,17.91 | 28.92,17.91 28.18,18.66 27.92,18.66 v27.8,18.53 | v26.88,14.13 26.57,14.13 25.47,15.23 18.91,15.23 v18.65,14.98
FEED_6  (via drill 0.35)
  Top 0.254: v22.15,19.65 22.15,20.18 R14.1 21.02,20.73 20.92,20.83 15.85,20.83 14.08,22.6 14.08,27.8 10.84,31.05 6.16,31.05 J2.14
  Bottom 0.254: U1.72 U1.71 | U1.71 U1.70 U1.69 U1.68 U1.67 U1.66 | U1.71 23.92,17.46 23.64,17.75 22.57,17.75 22.06,18.26 22.06,19.56 v22.15,19.65
FEED_7  (via drill 0.35)
  Top 0.254: 22.52,22 v22.62,21.9 22.81,21.71 22.81,21.34 23.29,20.87 23.29,20.37 23.97,19.69 26.03,19.69 v26.15,19.57 | 22.52,22 | 22.52,22 22.25,22.27 15.3,22.27 14.59,22.98 14.59,28 10.35,32.23 10.36,32.23 7.34,32.23 J2.15 | R15.1 24.58,25.56 24.74,25.39 24.74,24.9 24.75,24.9 24.75,23.87 25.06,23.56 v25.89,23.56
  Bottom 0.254: U1.73 U1.74 U1.75 21.92,16.6 21.45,16.12 20.68,16.12 20.25,16.55 U1.76 | U1.76 U1.77 U1.78 | v22.62,21.9 22.51,21.78 22.51,21.75 21.32,20.56 | v25.89,23.56 25.89,19.83 v26.15,19.57 | 21.32,20.56 21.32,18.79 20.91,18.38 U1.76 | 21.32,20.56 21,20.88 U1.81
FEED_8  (via drill 0.35)
  Top 0.254: R16.1 21.7,25.42 v21.7,24.86 | v17.76,22.98 15.48,22.98 15.1,23.36 15.1,28.39 10.33,33.16 6.24,33.16 5.22,32.14 J2.16
  Bottom 0.254: U1.88 U1.87 U1.86 U1.85 U1.84 U1.83 U1.82 | v21.7,24.86 21.49,24.86 21,24.38 U1.88 | v17.76,22.98 17.76,23.54 18.6,24.38 U1.88
GND  (via drill 0.35)
  Top 0.254: D16.C 17.68,27.85 v17.51,27.68 | D15.C 27.69,22.37 v28.18,22.85 | D7.C 24.28,37.99 25.94,37.99 26.12,38.17 26.12,39.38 26.51,39.76 27.77,39.76 v28.3,39.23
  Top 0.305: v28.43,19.3 v29.7,18.03
  Bottom 0.254: C1.1 18,25.99 | U1.60 29.42,15.82 28.95,15.35 C6.1 | U1.79 18.39,19.88 C7.1 18.27,16.78 19.41,15.64 26.6,15.64 26.97,16 26.97,16.66 U1.65 26.92,18.8 27.41,19.3 v28.43,19.3 | v17.51,27.68 17.09,27.26 16.46,27.26 16.02,26.82 16.02,26.07 16.26,25.83 17.87,25.83 C1.1 | U1.46 37.21,20.38 C3.1 | C1.1 18.41,25.98 19.34,26.91 20.22,26.91 U1.93
  Bottom 0.305: U1.11 U1.10 26.42,33.85 C9.1 | v29.7,18.03 29.42,17.75 U1.60 | U1.32 36.67,27.38 36.77,27.28 37.41,27.28 C8.1
  other vias: 15.48,16.76 31.91,13.43 29.91,14.2 38.72,29.2 38.46,25.77 23.52,35.01 25.89,34.88 37.45,18.91 30.32,34.84
  pour Bottom (no thermals): 0.41,49.66 47.02,49.66 47.02,0.52 0.41,0.52
  pour Route2 (no thermals): 0.21,49.92 0.21,0.29 47.27,0.29 47.27,49.92
  pour Top (no thermals): 0.5,49.54 0.5,0.6 46.89,0.6 46.89,49.54
GND3  (via drill 3.2)
  other vias: 43.93,39.53
INTERLOCK_INPUT_1  (via drill 0.35)
  Top 0.254: v19.81,39.48 16.5,39.48 v16.49,39.49 | v25,39.87 25,40.67 R1.1
  Bottom 0.254: v19.81,39.48 v19.82,39.49 24.37,39.49 24.75,39.87 v25,39.87 | U1.1 21.92,32.14 21.32,32.73 15.59,32.73 14.99,33.33 16.49,34.83 v16.49,39.49 16.49,34.92 11.59,30.02 11.59,19.61 10.09,18.11 J2.1
INTERLOCK_INPUT_2  (via drill 0.35)
  Top 0.254: v29.14,42 31.78,42 v31.79,42.02 32.23,42.02 R2.1 | v15.22,34.66 15.98,33.9 v15.98,33.39
  Bottom 0.254: v15.98,33.39 16.21,33.16 22.08,33.16 22.42,32.82 U1.2 | v29.14,42 28.48,42.66 18.79,42.66 17.75,41.62 17.75,40.61 17.28,40.15 16.22,40.15 15.6,39.53 15.6,35.68 15.22,35.3 v15.22,34.66 14.23,33.67 14.23,33.31 11.18,30.26 11.18,20.31 10,19.13 6.13,19.13 5.22,18.22 J2.2
INTERLOCK_INPUT_3  (via drill 0.35)
  Top 0.254: v14.84,36.57 17.13,36.57 v17.51,36.19 | v30.72,40 30.84,40.12 30.84,40.51 31.14,40.8 R3.1
  Bottom 0.254: v14.84,36.57 13.83,35.55 13.83,33.58 10.74,30.49 10.74,21.45 9.39,20.11 J2.3 | U1.3 22.92,33 22.02,33.9 17.64,33.9 16.98,34.56 16.98,35.57 17.51,36.1 v17.51,36.19 19.33,36.19 19.34,36.18 26.2,36.18 27.83,34.55 28.3,34.55 29.93,36.18 30.34,36.18 30.46,36.3 30.46,39.74 v30.72,40
INTERLOCK_INPUT_4  (via drill 0.35)
  Top 0.254: v13.57,36.57 13.78,36.57 14.82,35.53 17.91,35.53 v18.4,35.04 | v28.43,33.9 28.57,34.04 31.69,34.04 R4.1
  Bottom 0.254: U1.4 23.42,33.19 22.3,34.31 18.4,34.31 v18.4,35.04 18.34,35.04 19.07,35.77 25.93,35.77 27.64,34.05 28.28,34.05 v28.43,33.9 | v13.57,36.57 13.57,36.11 13.26,35.81 13.26,33.82 10.3,30.85 10.3,22.5 8.95,21.15 6.72,21.15 5.68,20.11 J2.4
INTERLOCK_INPUT_5  (via drill 0.35)
  Top 0.254: v14.21,38.73 19.29,38.73 v19.79,38.22 | v23.73,33.9 24.18,33.9 24.55,34.28 24.87,34.28 25.19,34.6 25.19,35.15 25.55,35.52 25.55,36.17
  Top 0.305: 25.55,36.17 R5.1 | v19.79,38.22 21.95,38.22 22.21,37.97 22.21,37.46 22.8,36.87 22.8,34.63 23.52,33.91 23.72,33.91 v23.73,33.9
  Bottom 0.254: v19.79,38.22 20.43,38.85 24.11,38.85 24.24,38.73 24.87,38.73 v25,38.85 | v23.73,33.9 23.73,33.52 23.92,33.33 U1.5 | J2.5 7.29,22.18 8.73,22.18 9.89,23.34 9.89,31.13 12.86,34.09 12.86,38.14 13.44,38.73 v14.21,38.73
INTERLOCK_INPUT_6  (via drill 0.35)
  Top 0.254: v13.06,39.49 13.06,38.35 13.57,37.84 16.86,37.84 18.19,36.51 R6.1 21.79,34.4 23.06,33.14 24.49,33.14 v24.87,33.52
  Bottom 0.254: v24.87,33.52 24.42,33.07 U1.6 | v13.06,39.49 12.3,38.73 12.3,34.96 12.45,34.81 12.45,34.26 12.07,33.88 11.9,33.88 9.42,31.39 9.42,24.13 8.36,23.07 6.73,23.07 5.77,22.11 J2.6
INTERLOCK_INPUT_7  (via drill 0.35)
  Top 0.254: R7.1 22.47,39.54 20.72,39.54 19.63,40.63 16.75,40.63 v16.49,40.89 | v11.79,34.54 13.7,34.54 15.86,32.38 v15.86,32
  Bottom 0.254: v16.49,40.89 16.16,40.55 13.2,40.55 11.79,39.15 v11.79,34.54 11.67,34.54 9,31.87 9,25.72 7.39,24.11 J2.7 | v15.86,32 19.41,32 20.43,30.98 24.75,30.98 24.92,31.15 U1.7
INTERLOCK_INPUT_8  (via drill 0.35)
  Top 0.254: J2.8 3.84,25.49 3.84,32.63 5.07,33.86 8.2,33.86 v8.24,33.9 | v8.24,33.9 9.13,34.79 10.52,34.79 11.14,35.4 11.14,39.47 13.22,41.55 19.5,41.55 19.61,41.43 19.82,41.26 20.98,40.1 21.23,40.1 R8.1 | v8.24,33.9 11.5,33.9 11.52,33.88 12.71,33.88 15.86,30.73 24.49,30.73 v25.13,30.09
  Bottom 0.254: U1.8 25.42,30.38 v25.13,30.09
INTERLOCK_OUT_1  (via drill 0.35)
  Top 0.254: v18.02,21.58 18.14,21.71 21.86,21.71 22.88,20.69 22.88,19.45 20.94,17.51 20.94,12.18 22.2,10.92 24.73,10.92 25.1,10.54 R22.1 25.6,11.42 32.88,11.42 37.07,15.61 39.99,15.61 v40.11,15.74 42.03,15.74 43.23,16.95 J1.1
  Bottom 0.254: v18.02,21.58 16.87,22.72 16.87,23.74 18.51,25.38 U1.90
INTERLOCK_OUT_2  (via drill 0.35)
  Top 0.254: v34.78,9.01 34.78,9.27 R23.1 | v22.46,11.68 21.95,12.18 21.95,17.47 22.94,18.46 v22.94,18.56
  Bottom 0.254: v22.94,18.56 22.86,18.65 23.39,19.18 23.39,24.72 22.23,25.88 U1.91 | v22.46,11.68 22.67,11.68 23.33,12.33 23.88,12.33 24.52,11.69 24.52,11.65 26.49,9.68 33.86,9.68 34.53,9.01 v34.78,9.01 35.03,9.26 38.08,9.26 41.23,12.41 J1.2
INTERLOCK_OUT_3  (via drill 0.35)
  Top 0.254: R24.1 31.82,10.44 34.04,8.22 35.27,8.22 36.18,9.14 36.18,11.04 36.94,11.8 37.57,11.8 38.34,11.04 v38.34,10.53 | v23.89,18.42 22.72,17.25 v22.72,12.69
  Bottom 0.254: U1.92 20.3,26.33 23.3,26.33 23.89,25.74 v23.89,18.42 | v22.72,12.69 22.97,12.95 23.86,12.95 26.53,10.27 38.08,10.27 v38.34,10.53 39.29,11.48 39.29,17.64 40.72,19.07 41.69,19.07 42.69,20.07 J1.3
INTERLOCK_OUT_4  (via drill 0.35)
  Top 0.254: R25.1 34.18,6.23 37.07,9.12 37.07,10.79 v37.32,11.04 | v25.17,18.36 24.96,18.36 24.44,17.84 24.44,13.78 v24.24,13.58
  Bottom 0.254: U1.95 20.3,27.92 22.73,27.92 24.36,26.3 24.36,19 24.99,18.36 v25.17,18.36 | v24.24,13.58 24.24,13.27 26.47,11.04 v37.32,11.04 38.73,12.45 38.73,17.72 41.07,20.07 J1.4
INTERLOCK_OUT_5  (via drill 0.35)
  Top 0.254: v25,9.01 25.47,8.54 R26.1 27.12,3.93 33.34,3.93 35.83,1.44 38.1,1.44 41.07,4.41 41.07,10.15 46,15.08 46,20.06 44.62,21.44 43.86,21.44 J1.5 | v26.18,18.34 26.18,18.05 25,16.88 25,13.07 v23.6,11.68
  Bottom 0.254: U1.96 23.03,28.38 25.01,26.4 25.01,19.77 26.18,18.59 v26.18,18.34 | v23.6,11.68 23.6,10.41 v25,9.01
INTERLOCK_OUT_6  (via drill 0.35)
  Top 0.254: v20.43,6.72 21.48,6.72 R27.1 | v45.31,18.52 45.31,15.22 40.54,10.44 40.54,7.63 39.63,6.72 v35.8,6.72
  Bottom 0.254: U1.97 20.17,28.79 17.15,28.79 15.96,27.6 15.4,27.6 15.22,27.42 15.22,20.95 17.13,19.04 17.13,11.8 20.43,8.5 v20.43,6.72 v35.8,6.72 | v45.31,18.52 45.28,18.55 45.28,20.29 44.46,21.12 42.84,21.12 41.89,22.07 J1.6
INTERLOCK_OUT_7  (via drill 0.35)
  Top 0.254: v19.67,7.61 20.3,7.61 20.34,7.65 21.32,7.65 R28.1 | J1.7 43.23,23.59 42.25,22.61 42.25,21.28 42.53,21.01 43.9,21.01 44.52,20.4 44.52,15.49 39.83,10.8 39.83,8.09 39.22,7.48 v36.81,7.48
  Bottom 0.254: U1.98 20.17,29.29 17.07,29.29 15.79,28.01 14.91,28.01 14.89,28.03 14.82,27.96 14.82,20.72 16.59,18.94 16.59,11.7 19.29,9.01 19.29,7.99 v19.67,7.61 19.77,7.51 19.77,6.45 20.78,5.44 35.78,5.44 36.81,6.47 v36.81,7.48
INTERLOCK_OUT_8  (via drill 0.35)
  Top 0.254: v18.52,8.75 20.08,8.75 R29.1
  Bottom 0.254: U1.99 20.17,29.79 17,29.79 15.62,28.42 15.08,28.42 15.05,28.44 14.71,28.44 14.28,28.01 14.28,20.42 16.14,18.56 16.14,11.14 v18.52,8.75 18.88,8.4 18.88,6.77 20.92,4.72 35.64,4.72 37.47,6.55 37.47,8.14 v37.83,8.5 38.51,8.5 45.98,15.97 45.98,20.85 43.8,23.02 42.52,23.02 41.47,24.07 J1.8
N$1
  Top 0.254: D2.A 35.98,42.77 R2.2
N$2
  Top 0.254: R3.2 30.97,38.43 30.97,36.83 D3.A
N$3
  Top 0.254: D4.A 34.82,34.88 R4.2
N$4
  Top 0.254: D5.A 28.59,36.14 R5.2
N$5
  Top 0.254: D6.A 20.77,35.08 R6.2
N$6
  Top 0.254: R7.2 23.29,39.21 23.29,36.59 D7.A
N$7
  Top 0.254: R8.2 20.55,41.75 19.55,42.75 D8.A
N$8
  Top 0.254: R16.2 19.89,26.96 D16.A
N$9
  Top 0.254: R1.2 D1.A
N$10
  Bottom 0.305: R21.2 21.36,40.92 Y1.1
N$11
  Top 0.254: D9.A 28.44,25.52 R9.2
N$12
  Top 0.254: R22.2 27.93,10.53 D17.A
N$13
  Top 0.254: D18.A 36,12.39 R23.2
N$14
  Top 0.254: D10.A 36.03,28.16 R10.2
N$15
  Top 0.254: D11.A 31.73,21.09 32.71,22.06 32.66,23.16 R11.2
N$16
  Top 0.254: R12.2 36.44,18.4 D12.A
N$17
  Top 0.254: D13.A 27.58,21.07 R13.2
N$18
  Top 0.254: R14.2 20.58,19.44 D14.A
N$19
  Top 0.254: R15.2 23.28,23.38 23.28,21.49 23.95,20.82 D15.A
N$26  (via drill 3.2)
  other vias: 3.55,39.53
N$27  (via drill 3.2)
  other vias: 3.8,9.3
N$28  (via drill 3.2)
  other vias: 43.68,9.3
N$29
  Top 0.254: R24.2 30.97,8.08 30.97,6.48 D19.A
N$30
  Top 0.254: D20.A 35.95,4 R25.2
N$31
  Top 0.254: R26.2 28.44,5.58 D21.A
N$32
  Top 0.254: R27.2 21.04,4.71 D22.A
N$33
  Top 0.254: R28.2 23.08,8.1 23.08,6.02 D23.A
N$34
  Top 0.254: R29.2 20.14,11.17 D24.A
TCK
  Bottom 0.254: J3.1 23.61,46.53 35.14,46.53 36.68,45 36.68,34.28 R20.1 37.51,33.45 36.37,33.45 36.19,33.27 35.74,33.27 34.35,31.88 34.35,31.23 34.16,31.03 33.69,31.03 33.42,31.3 U1.24
TDI
  Bottom 0.254: J3.9 32.45,43.22 33.13,42.54 33.13,36.73 32.63,36.24 32.63,34.52 33.15,34.01 R18.1 33.5,33.77 32.88,33.14 32.88,32.09 U1.23
TDO  (via drill 0.35)
  Top 0.254: J3.3 26.14,46.52 33.15,46.52 34.65,45.02 v34.65,44.19
  Bottom 0.254: v34.65,44.19 34.78,44.06 34.78,34.29 35.04,34.03 35.41,34.03 35.41,33.51 35.03,33.14 34.27,33.14 33.92,32.79 33.92,32.17
  Bottom 0.305: 35.41,34.03 R19.1 | 33.92,32.17 U1.25
TMS
  Bottom 0.254: J3.5 27.37,45.01 32.24,40.13 32.24,36.42 32.22,36.4 32.22,34.39 31.9,34.07 R17.1 32.13,34.07 32.42,33.78 U1.22

### Text on the board
tPlace: C:/Users/User/Downloads/chargenet (1).bmp | C:/Users/User/Downloads/chargenet_logo.bmp | INTERLOCK_CIRCUIT_BOARD / VERSION 1.1 / 2024/05/01 | INPUTS | FEEDBACKS | OUTPUTS